# Altium schematic sheet levelshifter1.SchDoc
size A
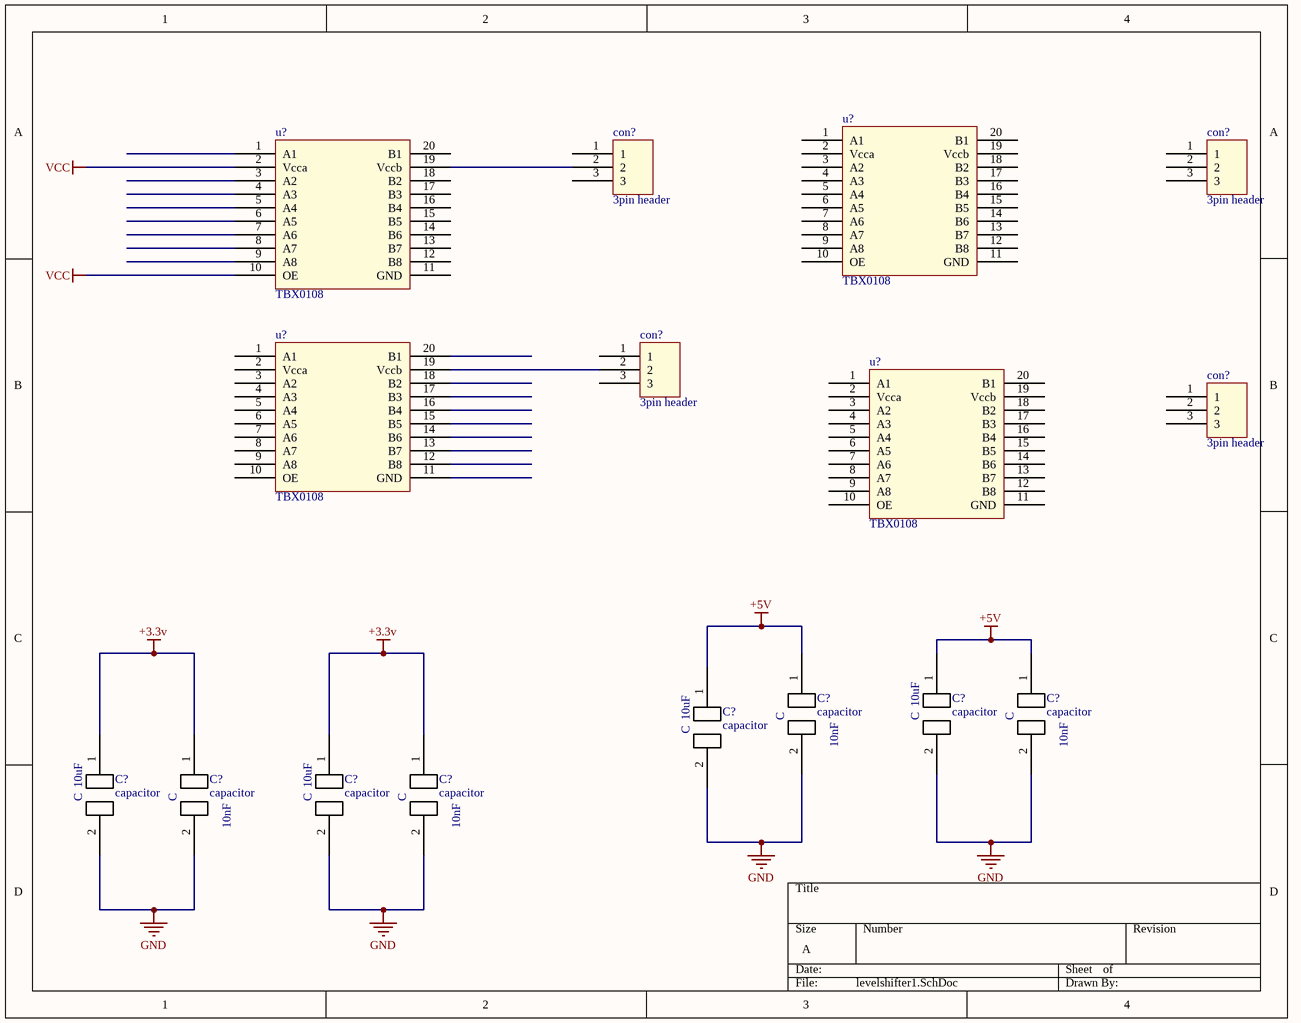
[diagram p0: levelshifter1.SchDoc]

## Parts
(Parts that share a designator on the sheet are numbered #1, #2 ... from top to bottom, then left to right.)
C?#1  capacitor  [0603]
C?#2  capacitor  [0603]
C?#3  capacitor  [0603]
C?#4  capacitor  [0603]
C?#5  capacitor  [0603]
C?#6  capacitor  [0603]
C?#7  capacitor  [0603]
C?#8  capacitor  [0603]
con?#1  3pin header  [PCBComponent_1]
con?#2  3pin header  [PCBComponent_1]
con?#3  3pin header  [PCBComponent_1]
con?#4  3pin header  [PCBComponent_1]
u?#1  TBX0108  [TXB0810]
u?#2  TBX0108  [TXB0810]
u?#3  TBX0108  [TXB0810]
u?#4  TBX0108  [TXB0810]

## Nets
+3.3v: C?#5.1 C?#6.1 C?#7.1 C?#8.1
+5V: C?#1.1 C?#2.1 C?#3.1 C?#4.1
GND: C?#1.2 C?#2.2 C?#3.2 C?#4.2 C?#5.2 C?#6.2 C?#7.2 C?#8.2
VCC: u?#2.2(Vcca) u?#2.10(OE)
Netcon?#1_2: con?#1.2 u?#2.19(Vccb)
Netcon?#3_2: con?#3.2 u?#3.19(Vccb)

Not connected (* = marked no-connect by the designer): con?#1 1 3; con?#2 1 2 3; con?#3 1 3; con?#4 1 2 3; u?#1 1(A1) 2(Vcca) 3(A2) 4(A3) 5(A4) 6(A5) 7(A6) 8(A7) 9(A8) 10(OE) 11(GND) 12(B8) 13(B7) 14(B6) 15(B5) 16(B4) 17(B3) 18(B2) 19(Vccb) 20(B1); u?#2 1(A1) 3(A2) 4(A3) 5(A4) 6(A5) 7(A6) 8(A7) 9(A8) 11(GND) 12(B8) 13(B7) 14(B6) 15(B5) 16(B4) 17(B3) 18(B2) 20(B1); u?#3 1(A1) 2(Vcca) 3(A2) 4(A3) 5(A4) 6(A5) 7(A6) 8(A7) 9(A8) 10(OE) 11(GND) 12(B8) 13(B7) 14(B6) 15(B5) 16(B4) 17(B3) 18(B2) 20(B1); u?#4 1(A1) 2(Vcca) 3(A2) 4(A3) 5(A4) 6(A5) 7(A6) 8(A7) 9(A8) 10(OE) 11(GND) 12(B8) 13(B7) 14(B6) 15(B5) 16(B4) 17(B3) 18(B2) 19(Vccb) 20(B1)

## Notes on the sheet
- (in symbol capacitor) 10uF; C; 10nF